# EAGLE design COUNTER2 (EAGLE 9.6.0)
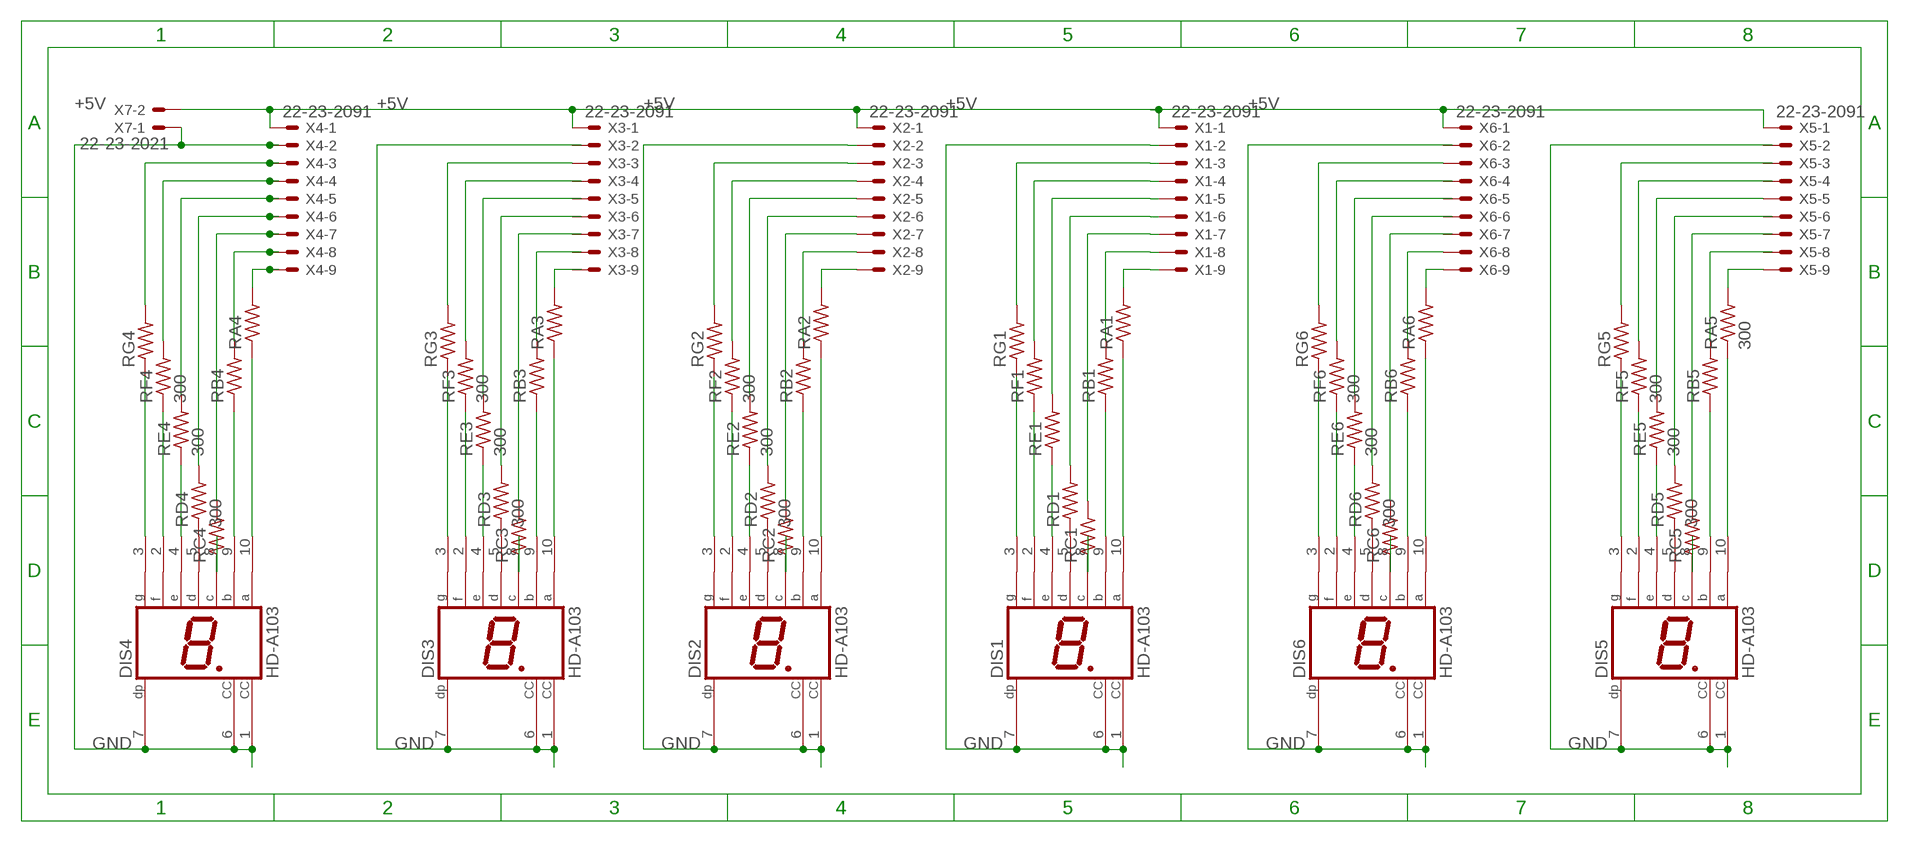
[diagram p0: schematic, sheet 1]

## Parts
DIS1  HD-A103  [HDSP-A]
DIS2  HD-A103  [HDSP-A]
DIS3  HD-A103  [HDSP-A]
DIS4  HD-A103  [HDSP-A]
DIS5  HD-A103  [HDSP-A]
DIS6  HD-A103  [HDSP-A]
RA1  R-US_R0805  [R0805]
RA2  R-US_R0805  [R0805]
RA3  R-US_R0805  [R0805]
RA4  R-US_R0805  [R0805]
RA5  300  R-US_R0805  [R0805]
RA6  R-US_R0805  [R0805]
RB1  R-US_R0805  [R0805]
RB2  R-US_R0805  [R0805]
RB3  R-US_R0805  [R0805]
RB4  R-US_R0805  [R0805]
RB5  R-US_R0805  [R0805]
RB6  R-US_R0805  [R0805]
RC1  R-US_R0805  [R0805]
RC2  R-US_R0805  [R0805]
RC3  R-US_R0805  [R0805]
RC4  R-US_R0805  [R0805]
RC5  R-US_R0805  [R0805]
RC6  R-US_R0805  [R0805]
RD1  R-US_0204/5  [0204/5]
RD2  300  R-US_0204/5  [0204/5]
RD3  300  R-US_0204/5  [0204/5]
RD4  300  R-US_0204/5  [0204/5]
RD5  300  R-US_0204/5  [0204/5]
RD6  300  R-US_0204/5  [0204/5]
RE1  R-US_0204/5  [0204/5]
RE2  300  R-US_0204/5  [0204/5]
RE3  300  R-US_0204/5  [0204/5]
RE4  300  R-US_0204/5  [0204/5]
RE5  300  R-US_0204/5  [0204/5]
RE6  300  R-US_0204/5  [0204/5]
RF1  R-US_0204/5  [0204/5]
RF2  300  R-US_0204/5  [0204/5]
RF3  300  R-US_0204/5  [0204/5]
RF4  300  R-US_0204/5  [0204/5]
RF5  300  R-US_0204/5  [0204/5]
RF6  300  R-US_0204/5  [0204/5]
RG1  R-US_0204/5  [0204/5]
RG2  R-US_0204/5  [0204/5]
RG3  R-US_0204/5  [0204/5]
RG4  R-US_0204/5  [0204/5]
RG5  R-US_0204/5  [0204/5]
RG6  R-US_0204/5  [0204/5]
X1  22-23-2091  [22-23-2091]
X2  22-23-2091  [22-23-2091]
X3  22-23-2091  [22-23-2091]
X4  22-23-2091  [22-23-2091]
X5  22-23-2091  [22-23-2091]
X6  22-23-2091  [22-23-2091]
X7  22-23-2021  [22-23-2021]

## Nets
+5V: X1.1 X2.1 X3.1 X4.1 X5.1 X6.1 X7.2
GND: DIS1.1(CC) DIS1.6(CC) DIS1.7(DP) DIS2.1(CC) DIS2.6(CC) DIS2.7(DP) DIS3.1(CC) DIS3.6(CC) DIS3.7(DP) DIS4.1(CC) DIS4.6(CC) DIS4.7(DP) DIS5.1(CC) DIS5.6(CC) DIS5.7(DP) DIS6.1(CC) DIS6.6(CC) DIS6.7(DP) X1.2 X2.2 X3.2 X4.2 X5.2 X6.2 X7.1
N$1: RA1.2 X1.9
N$2: DIS2.10(A) RA2.1
N$3: RB2.2 X2.8
N$4: DIS2.9(B) RB2.1
N$5: RC2.2 X2.7
N$6: DIS2.8(C) RC2.1
N$7: RD2.2 X2.6
N$8: DIS2.5(D) RD2.1
N$9: RE2.2 X2.5
N$10: DIS2.4(E) RE2.1
N$11: RF2.2 X2.4
N$12: DIS2.2(F) RF2.1
N$13: RG2.2 X2.3
N$14: DIS2.3(G) RG2.1
N$15: RA2.2 X2.9
N$16: DIS3.10(A) RA3.1
N$17: RB3.2 X3.8
N$18: DIS3.9(B) RB3.1
N$19: RC3.2 X3.7
N$20: DIS3.8(C) RC3.1
N$21: RD3.2 X3.6
N$22: DIS3.5(D) RD3.1
N$23: RE3.2 X3.5
N$24: DIS3.4(E) RE3.1
N$25: RF3.2 X3.4
N$26: DIS3.2(F) RF3.1
N$28: DIS3.3(G) RG3.1
N$29: RA3.2 X3.9
N$30: DIS4.10(A) RA4.1
N$31: RB4.2 X4.8
N$32: DIS4.9(B) RB4.1
N$33: RC4.2 X4.7
N$34: DIS4.8(C) RC4.1
N$35: RD4.2 X4.6
N$36: DIS4.5(D) RD4.1
N$37: RE4.2 X4.5
N$38: DIS4.4(E) RE4.1
N$39: RF4.2 X4.4
N$40: DIS4.2(F) RF4.1
N$41: RG4.2 X4.3
N$42: DIS4.3(G) RG4.1
N$43: RA4.2 X4.9
N$44: DIS5.10(A) RA5.1
N$45: RB5.2 X5.8
N$46: DIS5.9(B) RB5.1
N$47: RC5.2 X5.7
N$48: DIS5.8(C) RC5.1
N$49: RD5.2 X5.6
N$50: DIS5.5(D) RD5.1
N$51: RE5.2 X5.5
N$52: DIS5.4(E) RE5.1
N$53: RF5.2 X5.4
N$54: DIS5.2(F) RF5.1
N$55: RG5.2 X5.3
N$56: DIS5.3(G) RG5.1
N$57: RA5.2 X5.9
N$58: DIS6.10(A) RA6.1
N$59: RB6.2 X6.8
N$60: DIS6.9(B) RB6.1
N$61: RC6.2 X6.7
N$62: DIS6.8(C) RC6.1
N$63: RD6.2 X6.6
N$64: DIS6.5(D) RD6.1
N$65: RE6.2 X6.5
N$66: DIS6.4(E) RE6.1
N$67: RF6.2 X6.4
N$68: DIS6.2(F) RF6.1
N$69: RG6.2 X6.3
N$70: DIS6.3(G) RG6.1
N$71: RA6.2 X6.9
N$72: RG3.2 X3.3
N$92: DIS1.10(A) RA1.1
N$93: RB1.2 X1.8
N$94: DIS1.9(B) RB1.1
N$95: RC1.2 X1.7
N$96: DIS1.8(C) RC1.1
N$97: RD1.2 X1.6
N$98: DIS1.5(D) RD1.1
N$99: RE1.2 X1.5
N$100: DIS1.4(E) RE1.1
N$101: RF1.2 X1.4
N$102: DIS1.2(F) RF1.1
N$103: RG1.2 X1.3
N$104: DIS1.3(G) RG1.1

## Library data of the parts
DIS1-DIS6 = display-hp:HD-A103: LED DISPLAY 1-character 7 segment, decimal point right; OC_FARNELL: unknown; OC_NEWARK: unknown
RA1-RA6 RB1-RB6 RC1-RC6 RD1-RD6 RE1-RE6 RF1-RF6 RG1-RG6 = resistor:R-US_: RESISTOR, American symbol
X1-X6 = con-molex:22-23-2091: .100" (2.54mm) Center Header - 9 Pin; MF: MOLEX; MPN: 22-23-2091; OC_FARNELL: 1756827; OC_NEWARK: 56H0450
X7 = con-molex:22-23-2021: .100" (2.54mm) Center Header - 2 Pin; MF: MOLEX; MPN: 22-23-2021; OC_FARNELL: 1462926; OC_NEWARK: 25C3832

## Board
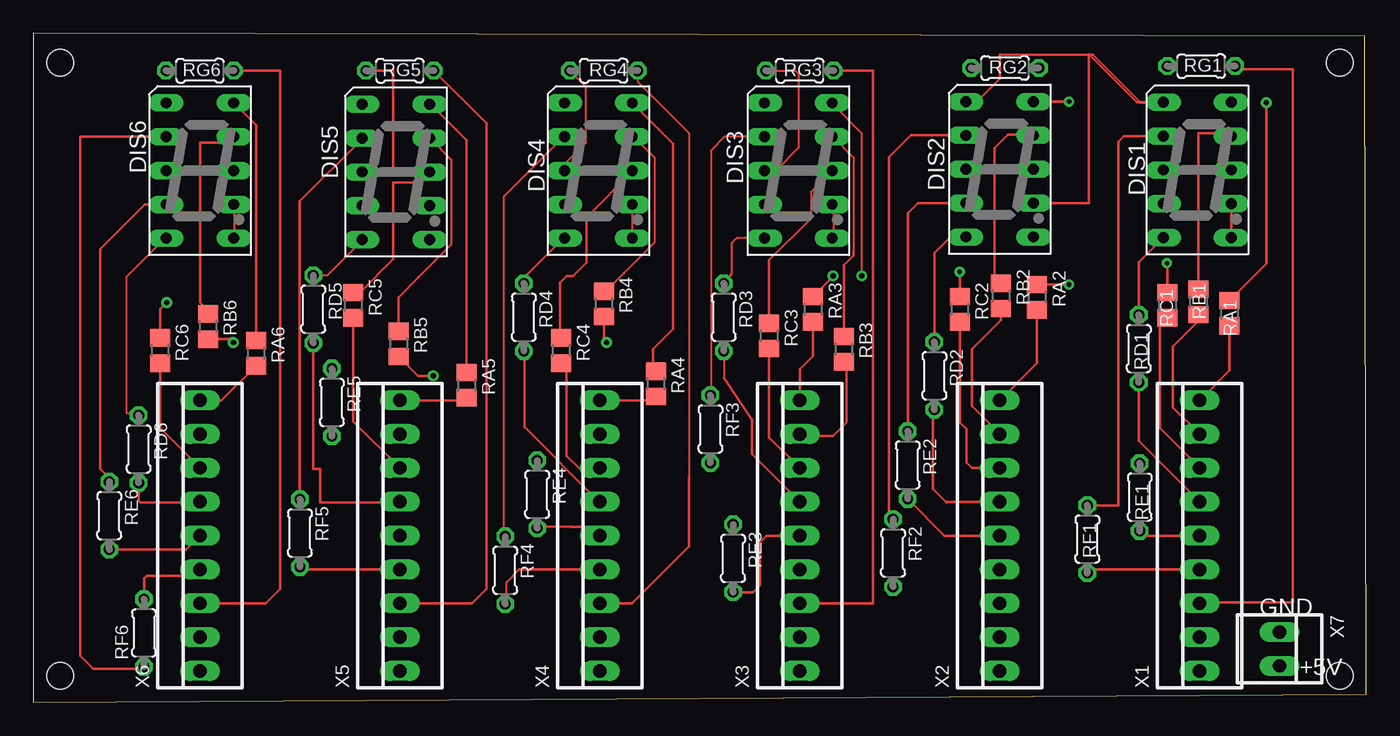
[diagram p1: board, top side]
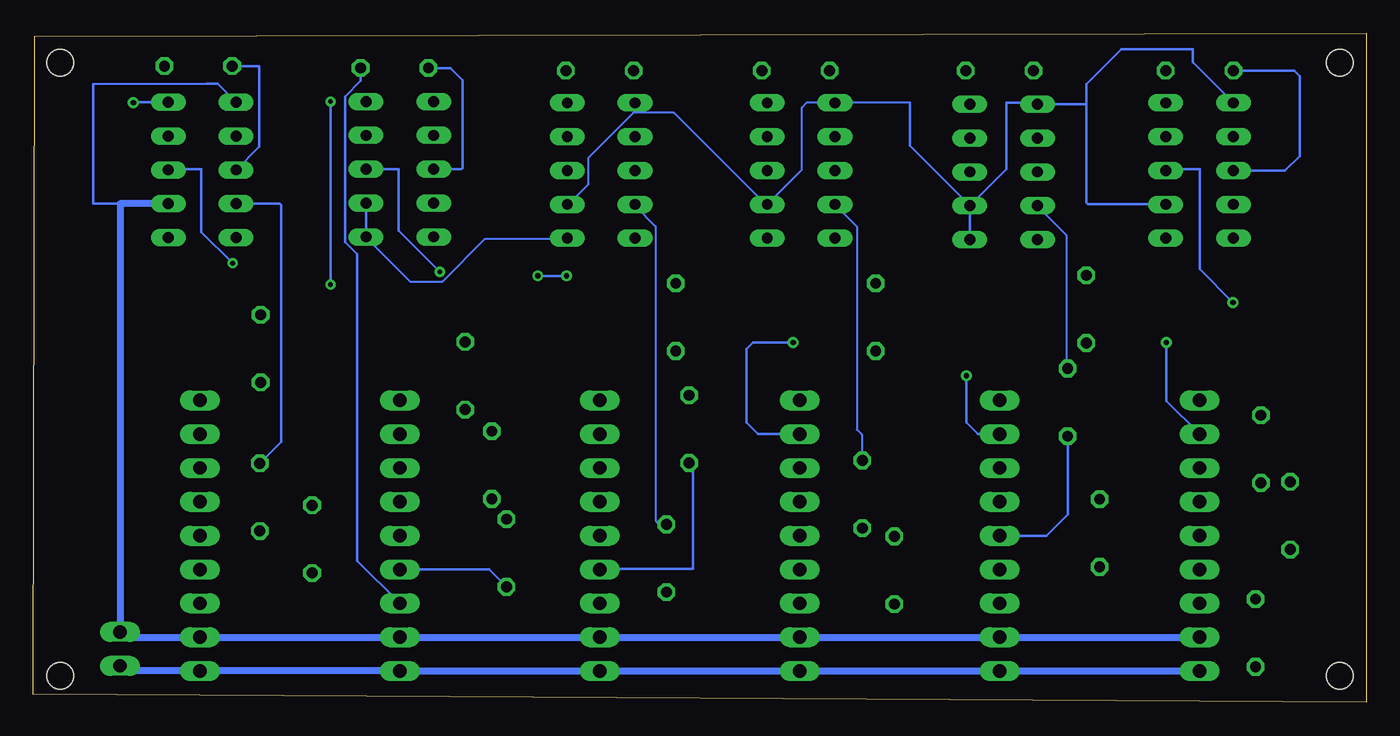
[diagram p2: board, bottom side, seen from below]

Size 100 x 50.2 mm. Coordinates in mm from the lower left corner, seen from the top.
Outline: 0,0 100,0.6 99.9,50 0,50.2 0,0
Copper layers (1*16): Top 0.035mm / dielectric 1.5mm / Bottom 0.035mm
Design rules "default": minimum track width 6mil, minimum drill 0.35mm, track to track 6mil, track to pad 6mil, pad to pad 6mil, via to via 6mil, smd to smd 6mil, copper to edge 40mil, drill to drill 6mil, minimum pad ring 10mil, minimum via ring 8mil, stop-mask expansion 4mil, vias tented up to drill 0mil, thermal gap 10mil
Holes 2 mm at 2,2 98,48 2,48 98,2

### Footprints (pad centres in the part's own frame; a part is rotated, then mirrored left to right if it is on the bottom)
HDSP-A = drill 0.813 long: 1 -2.54,5.08; 2 -2.54,2.54; 3 -2.54,0; 4 -2.54,-2.54; 5 -2.54,-5.08; 6 2.54,-5.08; 7 2.54,-2.54; 8 2.54,0; 9 2.54,2.54; 10 2.54,5.08
R0805 = smd 1.3 x 1.5: 1 -0.95,0; 2 0.95,0
0204/5 = drill 0.813 octagon: 1 -2.54,0; 2 2.54,0
22-23-2091 = drill 1 long: 1 -10.16,0; 2 -7.62,0; 3 -5.08,0; 4 -2.54,0; 5 0,0; 6 2.54,0; 7 5.08,0; 8 7.62,0; 9 10.16,0
22-23-2021 = drill 1 long: 1 -1.27,0; 2 1.27,0

### Placement (x,y rotation side)
DIS1  87.33,39.95 0 top
DIS2  72.5,40 0 top
DIS3  57.4,39.9 0 top
DIS4  42.4,39.9 0 top
DIS5  27.2,39.8 0 top
DIS6  12.5,39.9 0 top
RA1  89.73,29.19 270 top
RA2  75.3,30.4 270 top
RA3  58.5,29.5 270 top
RA4  46.7,23.9 270 top
RA5  32.5,23.8 270 top
RA6  16.7,26.2 270 top
RB1  87.4,30.04 270 top
RB2  72.6,30.5 270 top
RB3  60.8,26.5 270 top
RB4  42.8,29.9 270 top
RB5  27.4,26.9 270 top
RB6  13.1,28.2 270 top
RC1  85.07,29.79 270 top
RC2  69.5,29.5 270 top
RC3  55.2,27.5 270 top
RC4  39.6,26.4 270 top
RC5  24,29.8 270 top
RC6  9.5,26.4 270 top
RD1  82.94,26.54 270 top
RD2  67.6,24.5 270 top
RD3  51.8,28.9 270 top
RD4  36.8,28.9 270 top
RD5  21,29.5 270 top
RD6  7.9,19 270 top
RE1  83.01,15.39 270 top
RE2  65.6,17.8 270 top
RE3  52.5,10.8 270 top
RE4  37.8,15.6 270 top
RE5  22.4,22.5 270 top
RE6  5.7,14 270 top
RF1  79.08,12.24 270 top
RF2  64.5,11.2 270 top
RF3  50.8,20.5 270 top
RF4  35.4,9.9 270 top
RF5  20,12.7 270 top
RF6  8.3,5.2 90 top
RG1  87.62,47.74 0 top
RG2  72.9,47.6 0 top
RG3  57.5,47.4 0 top
RG4  42.8,47.4 0 top
RG5  27.5,47.4 0 top
RG6  12.5,47.4 0 top
X1  87.5,12.5 90 top
X2  72.5,12.5 90 top
X3  57.5,12.5 90 top
X4  42.5,12.5 90 top
X5  27.5,12.5 90 top
X6  12.5,12.5 90 top
X7  93.5,4 270 top

### Tracks (layer width: path | path; a pad name or v marks a point on that pad's centre or on a via)
+5V
  Bottom 0.508: X6.1 X5.1 27.89,2.73 28.28,2.34 X4.1 X3.1 X2.1 X1.1 93.5,2.34 X7.2
GND
  Top 0.152: DIS6.6 15.05,34.94 15.05,37.22 DIS6.7 | DIS3.6 60.01,34.94 60.01,37.22 DIS3.7 | DIS4.6 44.93,34.94 44.93,37.22 DIS4.7
  Top 0.2: DIS2.7 79.2,37.46 79.2,48.6 | 79.2,48.6 79.2,48.63 79.23,48.6 | 79.23,48.6 79.5,48.6 83.09,45.01 | 79.23,48.6 79.2,48.6 | DIS2.1 70.78,45.08 72.5,46.8 72.5,48.6 79.2,48.6 | 83.09,45.01 83,45.01 83,45.03 | 83,45.03 DIS1.1 84.77,45.01 83.09,45.01 | 83,45.03 82.8,45.03 79.23,48.6 | DIS1.6 DIS1.7
  Bottom 0.152: 15.05,37.38 DIS6.7 | 54.98,44.23 54.98,44.84 DIS3.1 | 54.98,44.23 58.34,40.88 58.34,38.9 59.86,37.38 DIS3.7 | DIS4.1 42,44.98 42.35,44.63 42.35,39.95 44.93,37.38 DIS4.7 45.08,37.38 51.94,44.23 54.98,44.23 | DIS4.1 39.9,44.84 39.9,44.54 DIS4.1 | 34.24,44.98 DIS4.1 | DIS3.6 60.01,34.78 66.11,34.78 69.31,31.59 71.75,31.59 74.95,34.78 DIS2.6
  Bottom 0.2: DIS5.6 DIS5.7 | DIS5.7 34.24,41.76 34.24,44.98 | DIS5.7 27,40 27,45 24.78,45 DIS5.1 21.12,44.88 21,45 | 21,45 21,46.37 18.37,49 13,49 13,48.02 DIS6.1 | 21,45 21,37.5 20.88,37.38 15.05,37.38 | DIS1.1 86.17,46.41 87,46.41 95.5,46.39 95.5,37.41 DIS1.7 | DIS2.6 DIS2.7
  Bottom 0.508: X6.2 X5.2 X4.2 X3.2 X2.2 X1.2 93.11,4.88 X7.1 93.5,37.41 DIS1.7
N$1
  Top 0.2: RA1.2 89.73,28 89.73,27.66 89.73,24.89 X1.9
N$2  (via drill 0.35)
  Top 0.2: RA2.1 v77.7,31.35 | v77.7,45.08 DIS2.10
  Bottom 0.2: v77.7,31.35 v77.7,45.08 | v77.7,45.08 77.7,45.2 77.6,45.2 77.6,45.1 77.62,45.08 v77.7,45.08
N$3
  Top 0.2: RB2.2 72.6,28.7 70.4,26.5 70.4,22.22 X2.8
N$4
  Top 0.2: RB2.1 72.1,31.95 72.1,41.6 73.1,42.6 74.98,42.6 DIS2.9
N$5
  Top 0.2: RC2.2 69.5,21 70,20.5 70,18 70.42,17.58 X2.7
N$6  (via drill 0.35)
  Top 0.2: RC2.1 v69.5,32.3
  Bottom 0.2: v69.5,32.3 72.6,35.4 72.6,40 DIS2.8
N$7
  Top 0.2: X2.6 68.54,15.04 68.5,15 67.5,16 67.5,21.86 RD2.2
N$8
  Top 0.2: RD2.1 67.6,33.7 68.82,34.92 DIS2.5
N$9
  Top 0.2: X2.5 68.36,12.5 RE2.2
N$10
  Top 0.2: RE2.1 65.6,36.7 66.36,37.46 DIS2.4
N$11
  Bottom 0.2: X2.4 65.8,9.96 RF2.2
N$12
  Top 0.2: RF2.1 64.2,14.04 64.2,40.9 65.84,42.54 DIS2.2
N$13
  Bottom 0.2: RG2.2 75.44,46.63 76.61,45.46 76.61,34.54 75.7,33.63 75.7,10.62 X2.3
N$14
  Bottom 0.2: RG2.1 68.7,47.6 67.8,46.7 67.8,40.1 67.9,40 DIS2.3
N$15
  Top 0.2: X2.9 75.3,25.46 RA2.2
N$16  (via drill 0.4)
  Top 0.152: v62.14,32 62.14,42.72 60.01,44.84 DIS3.10
  Top 0.2: RA3.1 60,31.95 v60,32
  Bottom 0.2: v62.14,32 v60,32
N$17
  Top 0.2: X3.8 57.62,20 60,20 61,21 61,25.35 RB3.2
N$18
  Top 0.152: 61.54,33.78 61.54,40.88 60.01,42.41 DIS3.9
  Top 0.2: 61.54,33.78 61.54,33.54 60.8,32.8 RB3.1
N$19
  Top 0.2: X3.7 55.2,19.88 RC3.2
N$20
  Top 0.152: 55.2,33.17 58.34,36.31 58.34,38.29 59.86,39.81 DIS3.8
  Top 0.2: RC3.1 55.2,33.17
N$21
  Top 0.152: 53.92,21.22 51.8,24.37 RD3.2
  Top 0.2: X3.6 53.92,18.62 53.92,21.22
N$22
  Top 0.152: DIS3.5 52.77,34.82 52.39,34.45 52.39,32.18 RD3.1
N$23
  Top 0.2: X3.5 55,12.5 54.5,12 54.5,8.76 54,8.26 RE3.2
N$24
  Bottom 0.152: RE3.1 52.5,12.86 52.55,12.84 53.31,13.6 53.31,35.7 54.83,37.22 DIS3.4
N$25
  Bottom 0.2: X3.4 57.46,10 50.5,10 50.5,17.66 RF3.2
N$26
  Top 0.152: RF3.1 50.83,23.04 50.83,41.4 51.87,42.44 DIS3.2
N$28
  Top 0.152: DIS3.3 55.71,39.9 57.41,41.6 57.41,47.16 57.17,47.4 RG3.1
N$29
  Top 0.2: X3.9 57.5,25 58.5,26 RA3.2
N$30
  Top 0.152: 46.91,43.02 45.08,44.84 DIS4.10
  Top 0.2: 46.91,43.02 48,41.92 48,28 46.5,26.5 46.5,25.05 RA4.1
N$31  (via drill 0.4)
  Top 0.2: v43,27 42.8,27.2 RB4.2
  Bottom 0.2: X4.8 45.62,20.12 46.5,21 46.5,26.5 46,27 v43,27
N$32
  Top 0.152: 44.32,32.19 46.6,34.48 46.6,40.88 45.08,42.41 DIS4.9
  Top 0.2: 44.32,32.19 42.97,30.85 RB4.1
N$33
  Top 0.2: RC4.2 40,25.05 40,18.5 41,17.5 42.42,17.5 X4.7
N$34
  Top 0.152: 41.57,36.46 44.93,39.81 DIS4.8
  Top 0.2: 41.57,36.46 41.5,36.39 41.5,33 40.5,32 40,32 39.5,31.5 39.5,27.45 RC4.1
N$35
  Top 0.152: 36.85,26.31 RD4.2
  Top 0.2: X4.6 42.46,15.04 36.85,20.65 36.85,26.31
N$36
  Top 0.152: RD4.1 36.85,31.49 36.85,31.89 39.74,34.78 DIS4.5
N$37
  Top 0.152: 40.35,13.14 37.85,13.14 RE4.2
  Top 0.2: 40.35,13.14 41.86,13.14 X4.5
N$38
  Bottom 0.152: RE4.1 37.85,18.19 37.85,20.09 38.22,20.46 38.22,35.7 39.74,37.22 DIS4.4
N$39
  Top 0.152: 35.5,9 35.5,7.46 RF4.2
  Top 0.2: 35.5,9 36.46,9.96 X4.4
N$40
  Top 0.152: RF4.1 35.4,12.88 35.28,12.96 35.28,37.94 39.74,42.41 DIS4.2
N$41
  Top 0.152: 49.21,17 49.21,42.69 45.38,46.52 45.38,47.28 RG4.2
  Top 0.2: X4.3 44.92,7.42 49.21,11.71 49.21,16.97 49.21,17
N$42
  Top 0.152: DIS4.3 39.9,39.97 39.9,40.42 41.42,41.95 41.42,46.22 40.35,47.28 RG4.1
N$43
  Top 0.2: RA4.2 46.41,22.66 X4.9
N$44
  Top 0.152: 31.67,43.02 29.84,44.84 DIS5.10
  Top 0.2: 31.67,43.02 32.5,42.18 RA5.1
N$45  (via drill 0.4)
  Top 0.2: v30,24.5 28.85,24.5 RB5.2
  Bottom 0.2: X5.8 29.12,20.12 30,21 v30,24.5
N$46
  Top 0.152: 28.92,31.89 31.36,34.33 31.36,40.73 29.84,42.25 DIS5.9
  Top 0.2: 28.92,31.89 27.4,30.37 RB5.1
N$47
  Top 0.2: X5.7 24,21.08 RC5.2
N$48
  Top 0.2: RC5.1 24.5,30.75 27,33.25 27,39 28.94,39 DIS5.8
N$49
  Top 0.2: X5.6 27.46,15 21.5,15 21.5,17.5 21,17.5 RD5.2
N$50
  Top 0.152: RD5.1 22.07,32.04 24.66,34.63 DIS5.5
N$51
  Bottom 0.2: X5.5 24,12.5 22.4,14.1 RE5.2
N$52
  Bottom 0.152: 22.48,25.04 22.48,35.05 24.66,37.22 DIS5.4
  Bottom 0.2: RE5.1 22.48,25.04
N$53
  Top 0.2: X5.4 20.2,9.96 RF5.2
N$54
  Top 0.152: 20,37.59 24.66,42.25 DIS5.2
  Top 0.2: 20,37.59 RF5.1
N$55
  Top 0.2: X5.3 32.92,7.42 34,8.5 34,43.44 RG5.2
N$56
  Top 0.2: DIS5.3 26.8,39.8 27,40 27,47.5 26.9,47.4 RG5.1
N$57
  Top 0.2: RA5.2 32.31,22.66 X5.9
N$58
  Top 0.2: DIS6.10 16.7,43.32 RA6.1
N$59  (via drill 0.4)
  Top 0.2: v15,27 14.75,27.25 RB6.2
  Bottom 0.2: X6.8 15,22.62 v15,27
N$60
  Top 0.2: RB6.1 13.1,29.4 12.5,30 12.5,42 14.6,42 DIS6.9
N$61
  Top 0.2: X6.7 9.5,20.58 RC6.2
N$62  (via drill 0.4)
  Top 0.2: v10,30 9.5,29.5 RC6.1
  Bottom 0.2: v10,30 12.5,32.5 12.5,40 14.94,40 DIS6.8
N$63
  Top 0.2: X6.6 12.46,15 8,15 7.9,15.1 RD6.2
N$64
  Top 0.152: RD6.1 6.98,21.72 6.98,31.89 9.87,34.78 DIS6.5
N$65
  Top 0.2: X6.5 11.46,11.46 RE6.2
N$66
  Top 0.2: RE6.1 5.7,16.8 5,17.5 5,34 8.36,37.36 DIS6.4
N$67
  Top 0.2: X6.4 12.04,9.5 8.5,9.5 8.3,9.3 RF6.2
N$68
  Top 0.2: RF6.1 8.14,2.5 4.5,2.5 3.5,3.5 3.5,42.44 DIS6.2
N$69
  Top 0.2: X6.3 17.42,7.42 18.5,8.5 18.5,47.4 RG6.2
N$70
  Bottom 0.2: DIS6.3 6.1,39.9 5,41 5,47 5.4,47.4 RG6.1
N$71
  Top 0.2: RA6.2 14.11,22.66 X6.9
N$72
  Top 0.2: RG3.2 63,47.4 63,7.42 X3.3
N$92  (via drill 0.4)
  Top 0.2: RA1.1 92.5,32.91 v92.5,45
  Bottom 0.2: DIS1.10 92.47,45.03 v92.5,45
N$93
  Top 0.2: X1.8 85.5,22.12 85.5,26.7 87.4,28.6 RB1.2
N$94
  Top 0.2: RB1.1 87.4,42.7 89.66,42.7 DIS1.9
N$95
  Top 0.2: RC1.2 85,28.77 84.77,28.77 84.5,28.5 84.5,20.58 X1.7
N$96  (via drill 0.35)
  Top 0.2: RC1.1 85.07,32.83 85,32.9 v85.05,32.95
  Bottom 0.2: v85.05,32.95 87.4,35.3 87.4,40 89.82,40 DIS1.8
N$97
  Top 0.2: X1.6 82.94,19.6 RD1.2
N$98
  Top 0.2: RD1.1 82.94,33.02 DIS1.5
N$99
  Top 0.2: X1.5 83.5,12.5 83.5,12.85 RE1.2
N$100
  Bottom 0.2: DIS1.4 81.51,37.41 81.4,37.3 81.4,19.54 RE1.1
N$101
  Top 0.2: X1.4 79.34,9.96 RF1.2
N$102
  Top 0.2: DIS1.2 81.83,42.49 81.4,42.06 81.4,14.78 RF1.1
N$103
  Top 0.2: X1.3 87.58,7.5 94.5,7.5 94.5,47.2 94.5,47.5 90.16,47.5 RG1.2
N$104
  Bottom 0.2: DIS1.3 83.04,41.7 83.04,47.74 RG1.1

### Text on the board
tNames: GND | +5V